# Altium schematic sheet RC522.SchDoc
size A4
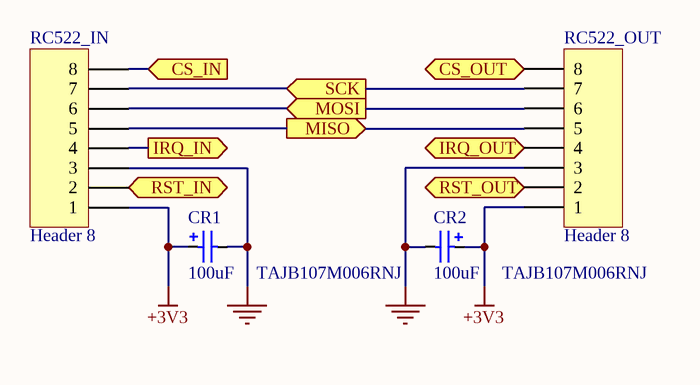
[diagram p0: RC522.SchDoc]

## Parts
CR1  value 100uF     TAJB107M006RNJ  [CAP_TAN_B_3518]  (hidden comment: Cap_Tan)
CR2  value 100uF     TAJB107M006RNJ  [CAP_TAN_B_3518]  (hidden comment: Cap_Tan)
RC522_IN  Header 8  [HX2.54-8]
RC522_OUT  Header 8  [HX2.54-8]

## Ports
CS_IN (in), CS_OUT (in), IRQ_IN (out), IRQ_OUT (out), MISO (out), MOSI (in), RST_IN (in), RST_OUT (in), SCK (in)

## Nets
+3V3: CR1.1 CR2.1 RC522_IN.1 RC522_OUT.1
GND: CR1.2 CR2.2 RC522_IN.3 RC522_OUT.3
CS_IN: RC522_IN.8 ; port CS_IN
CS_OUT: RC522_OUT.8 ; port CS_OUT
IRQ_IN: RC522_IN.4 ; port IRQ_IN
IRQ_OUT: RC522_OUT.4 ; port IRQ_OUT
MISO: RC522_IN.5 RC522_OUT.5 ; port MISO
MOSI: RC522_IN.6 RC522_OUT.6 ; port MOSI
RST_IN: RC522_IN.2 ; port RST_IN
RST_OUT: RC522_OUT.2 ; port RST_OUT
SCK: RC522_IN.7 RC522_OUT.7 ; port SCK

## Library data of the parts
CR1 CR2 = Cap_Tan: Capacitor
RC522_IN RC522_OUT = Header 8: Header, 8-Pin; LatestRevisionDate: 17-Jul-2002; LatestRevisionNote: Re-released for DXP Platform.; Publisher: Altium Limited